# EasyEDA Pro project WaterPumpDriver.eprj

# Schematic Schematic1
Board Name: Board1; Create Date: 2025-04-06; Page Name: P1; Project Name: WaterPumpDriver; Schematic Name: Schematic1; Update Date: 2025-04-06; Company: 嘉立创EDA; Drawed: 王大智; Page Size: A4; Version: V1.0
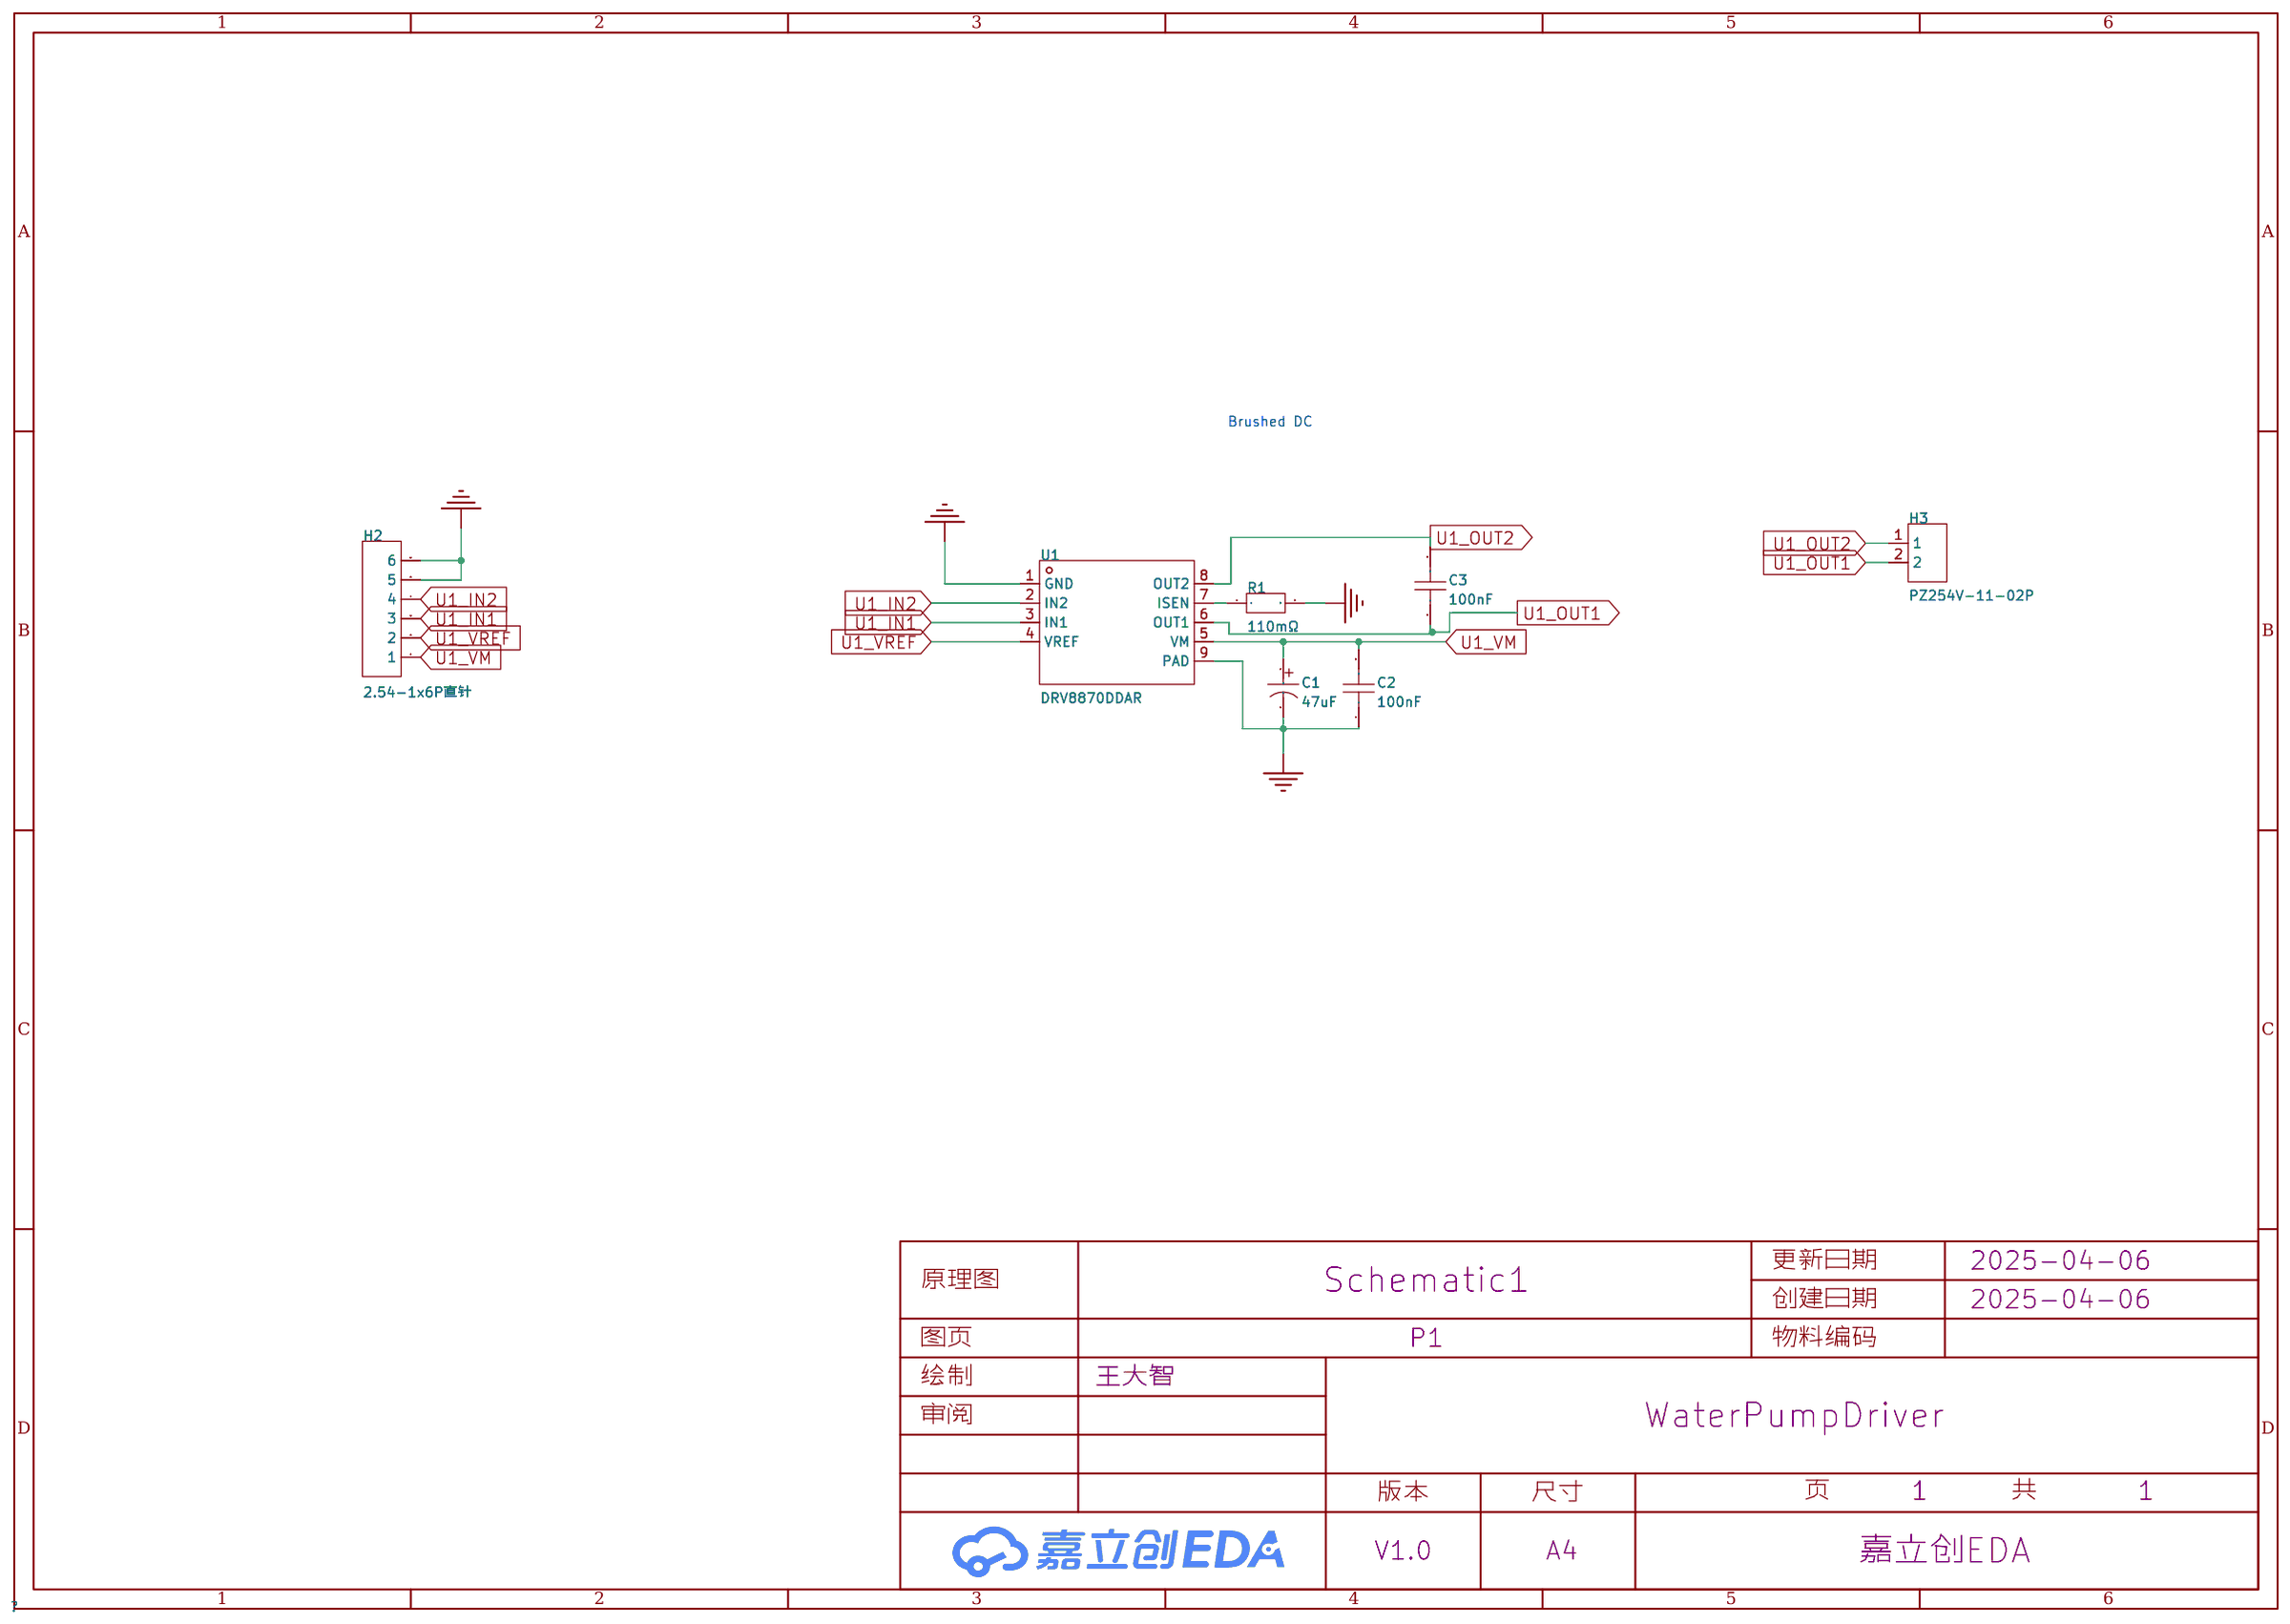
[diagram p0: schematic sheet]

## Parts
C1  47uF  [CAP-TH_BD6.3-P2.50-D1.0-FD]
C2  100nF  [C0603]
C3  100nF  [C0603]
H2  2.54-1x6P直针  [HDR-TH_6P-P2.54-V-M-1]
H3  PZ254V-11-02P  [HDR-TH_2P-P2.54-V-M]
R1  110mΩ  [R1206]
U1  DRV8870DDAR  [HSOP-8_L5.0-W4.0-P1.27-LS6.2-BL-EP]

## Library data of the parts
C1 = KM476M050E11RR0VH2FP0: LCSC Part Name: 47uF ±20% 50V; Supplier Part: C45101; Manufacturer: CX(承兴); Supplier Footprint: 插件,D6.3xL11mm; JLCPCB Part Class: 扩展库; Datasheet: https://atta.szlcsc.com/upload/public/pdf/source/20230413/4F329AA96A66424FD3FF29340EA7427F.pdf; Supplier: LCSC; Tolerance: ±20%; Rated Voltage: 50V; Lead Spacing: 2.5mm; φD: 6.3mm; L: 11mm; Lifetime @ Temp: 1000hrs@105℃
C2 C3 = CGA0603X7R104K500JT: LCSC Part Name: 100nF ±10% 50V; Supplier Part: C6119867; Manufacturer: HRE(芯声); Supplier Footprint: 0603; JLCPCB Part Class: Extended Part; Datasheet: https://atta.szlcsc.com/upload/public/pdf/source/20250103/C44077DA9E7B3EFAE02F22B6D3D1CBC9.pdf; Supplier: LCSC; Tolerance: ±10%; Voltage Rating: 50V; Temperature Coefficient: X7R
H2 = 2.54-1x6P直针: LCSC Part Name: 1x6P 间距:2.54mm 方针 直插; Supplier Part: C37208; Manufacturer: BOOMELE(博穆精密); Supplier Footprint: 插件,P=2.54mm; JLCPCB Part Class: 扩展库; Datasheet: https://atta.szlcsc.com/upload/public/pdf/source/20250115/42A019761A40C8B839643401D8CA5A96.pdf; Supplier: LCSC; Pin Structure: 1x6P; Pitch: 2.54mm; Circluar Pins/Square Pins: 方针; Mounting Type: 直插; Number of Rows: 单排; Number of Pins: 6P; Current Rating: 3A; Contact Material: 黄铜; Operating Temperature: -40℃~+105℃; Color: 黑色
H3 = PZ254V-11-02P: LCSC Part Name: 1x2P 间距:2.54mm 方针 直插; Supplier Part: C492401; Manufacturer: XFCN(兴飞); Supplier Footprint: 插件,P=2.54mm; JLCPCB Part Class: 扩展库; Datasheet: https://atta.szlcsc.com/upload/public/pdf/source/20200309/C492401_A812433581A9B211A7FFA413ADDFF0E5.pdf; Supplier: LCSC; Pin Structure: 1x2P; Pitch: 2.54mm; Circluar Pins/Square Pins: 方针; Mounting Type: 直插; Number of Rows: 单排; Number of Pins: 2P; Length of Mating Pin: 6mm; Insulation Height: 2.5mm; Length of End Connection Pin: 3mm; Contact Material: 黄铜; Operating Temperature: -40℃~+105℃; Color: 黑色
R1 = FRL1206FR110TS: LCSC Part Name: 110mΩ ±1% 250mW 厚膜电阻; Supplier Part: C2934288; Manufacturer: FOJAN(富捷); Supplier Footprint: 1206; JLCPCB Part Class: 扩展库; Datasheet: https://atta.szlcsc.com/upload/public/pdf/source/20211221/925EC7D7225764EE0046F22065062C87.pdf; Supplier: LCSC; Type: 厚膜电阻; Tolerance: ±1%; Power(Watts): 250mW; Overload Voltage (Max): 500V; Temperature Coefficient: ±600ppm/℃; Operating Temperature Range: -55℃~+155℃
U1 = DRV8870DDAR: Supplier Part: C86590; Manufacturer: TI(德州仪器); Supplier Footprint: HSOP-8-EP; JLCPCB Part Class: 扩展库; Datasheet: https://www.ti.com/cn/lit/gpn/drv8870; Supplier: LCSC

## Nets
GND: C1.2 C2.1 H2.5 H2.6 R1.2 U1.1(GND) U1.9(PAD)
U1_IN1: H2.3 U1.3(IN1)
U1_IN2: H2.4 U1.2(IN2)
U1_OUT1: C3.1 H3.2 U1.6(OUT1)
U1_OUT2: C3.2 H3.1 U1.8(OUT2)
U1_VM: C1.1 C2.2 H2.1 U1.5(VM)
U1_VREF: H2.2 U1.4(VREF)
$1N341: R1.1 U1.7(ISEN)

## Notes on the sheet
- Brushed DC

# Board PCB1
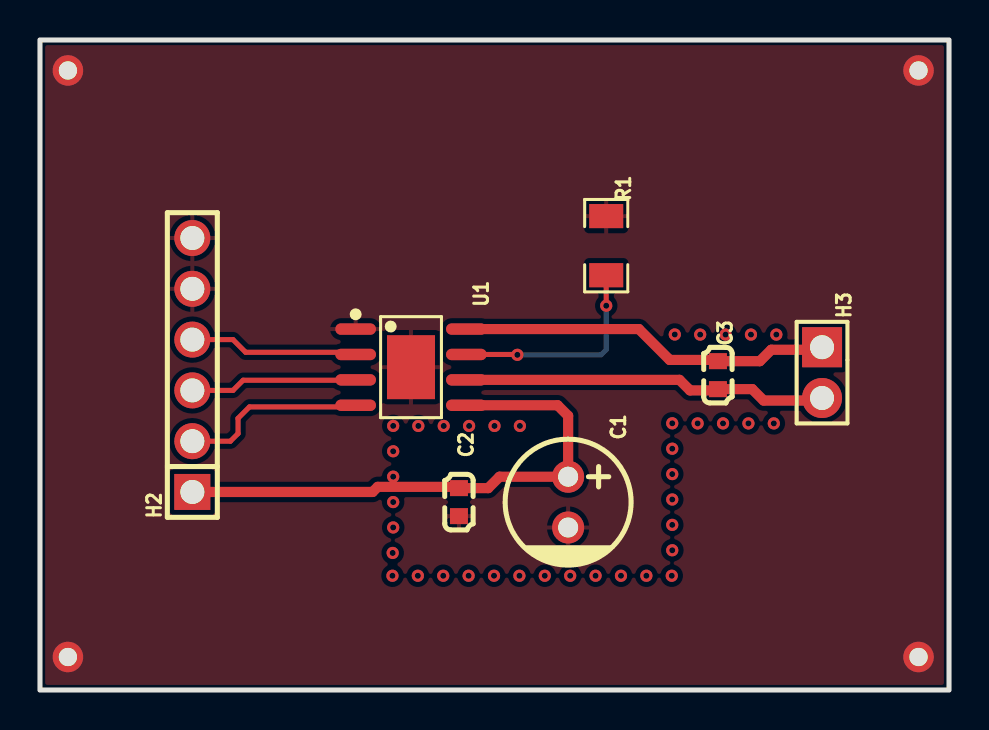
[diagram p1: board, top side]
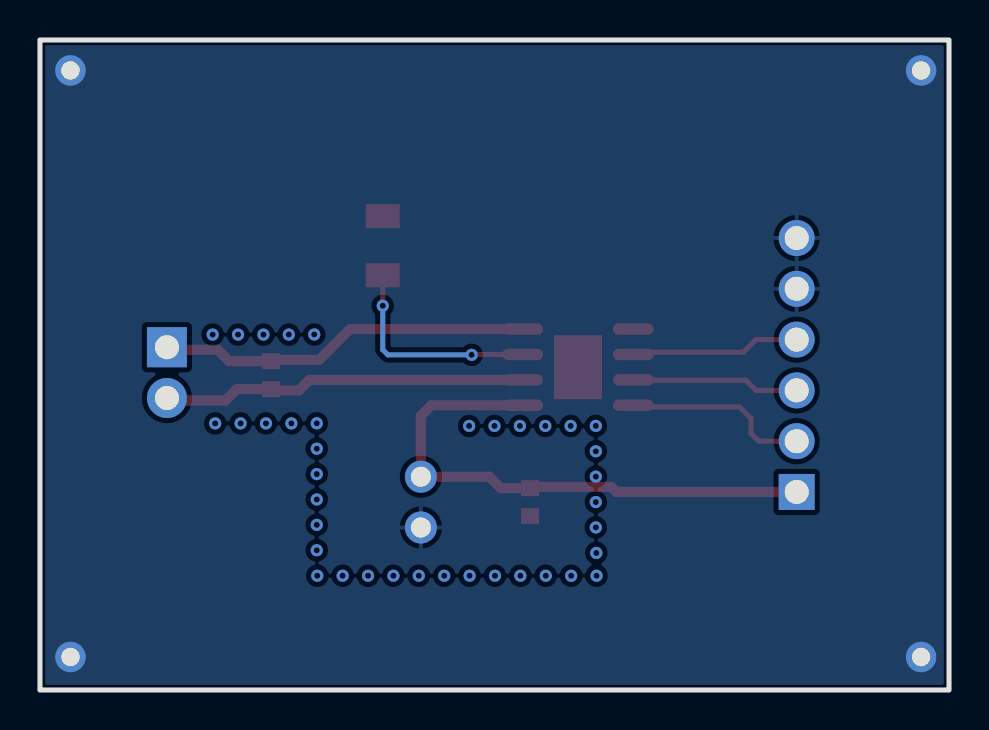
[diagram p2: board, bottom side, seen from below]

Outline 45.47 x 32.51 mm; copper layers: Top Layer, Bottom Layer. Coordinates in mm from the lower left corner of the outline.
Outline path: rectangle 0,32.51 45.47,0
Stack: Top Layer 0.035mm / Dielectric1 1.51mm FR4 er 4.5 / Bottom Layer 0.035mm

## Design rules (mm)
template: JLCPCB Capability(Two Layers Board)
spacing copperThickness1oz (default): track to track 0.102, other pairs 0.152 to 0.3
spacing copperThickness2oz: track to track 0.203, other pairs 0.152 to 0.3
track width copperThickness1oz (default): min 0.127, default 0.254, max 2.54
track width copperThickness2oz: min 0.203, default 0.254, max 2.54
differential pair differentialPair (default): width min 0.127, default 0.254, max 2.54; gap min 0.152, default 0.152
via viaSize (default): diameter min 0.5, default 0.61, max 10; hole min 0.3, default 0.305, max 6.3

## Placement (name value [footprint] x y rotation side)
C1  47uF  [CAP-TH_BD6.3-P2.50-D1.0-FD]  26.42 9.4 270 top
C2  100nF  [C0603]  20.96 9.4 90 top
C3  100nF  [C0603]  33.91 15.75 90 top
H2  2.54-1x6P直针  [HDR-TH_6P-P2.54-V-M-1]  7.62 16.26 90 top
H3  PZ254V-11-02P  [HDR-TH_2P-P2.54-V-M]  39.12 15.88 270 top
NOREF  -  [Pad_e205]  1.4 30.99 0 top
NOREF#2  -  [Pad_e206]  43.94 30.99 0 top
NOREF#3  -  [Pad_e208]  43.94 1.65 0 top
NOREF#4  -  [Pad_e207]  1.4 1.65 0 top
R1  110mΩ  [R1206]  28.32 22.22 90 top
U1  DRV8870DDAR  [HSOP-8_L5.0-W4.0-P1.27-LS6.2-BL-EP]  18.56 16.15 270 top

## Footprints (pads in the part's own frame, mm; a bottom-side part is the same pattern mirrored in y, then rotated)
C0603
  rect 0.8x0.9 smd: 1(-0.7,0) 2(0.7,0)
CAP-TH_BD6.3-P2.50-D1.0-FD
  round 1.6 hole 1: 1(-1.27,0) 2(1.27,0)
HDR-TH_2P-P2.54-V-M
  rect 2x2 hole 1.2: 1(-1.27,0)
  round 2 hole 1.2: 2(1.27,0)
HDR-TH_6P-P2.54-V-M-1
  rect 1.8x1.8 hole 1.2: 1(-6.35,0)
  round 1.8 hole 1.2: 2(-3.81,0) 3(-1.27,0) 4(1.27,0) 5(3.81,0) 6(6.35,0)
HSOP-8_L5.0-W4.0-P1.27-LS6.2-BL-EP
  oval 0.574x2.038 smd: 1(-1.905,-2.769) 2(-0.635,-2.769) 3(0.635,-2.769) 4(1.905,-2.769) 5(1.905,2.769) 6(0.635,2.769) 7(-0.635,2.769) 8(-1.905,2.769)
  rect 3.2x2.4 smd: 9(0,0)
Pad_e205
  round 1.524 hole 0.914: 1(0,0)
Pad_e206
  round 1.524 hole 0.914: 2(0,0)
Pad_e207
  round 1.524 hole 0.914: 3(0,0)
Pad_e208
  round 1.524 hole 0.914: 4(0,0)
R1206
  rect 1.208x1.701 smd: 1(-1.479,0) 2(1.479,0)

## Nets
As in the schematic, except:
GND: C1.2 C2.1 H2.5 H2.6 NOREF.1 NOREF#2.2 NOREF#3.4 NOREF#4.3 R1.2 U1.1 U1.9

## Via types
v1: diameter 0.61, hole 0.305, Top Layer to Bottom Layer, 40 vias

## Routing (per net, layer and track width the routed paths; a pad name or vN(x,y) marks a point on that pad's centre or on a via; arc(x,y) is an arc through that point)
(no net):
  vias: v1(17.64,6.86) v1(17.63,5.72) v1(17.67,13.21) v1(17.67,11.94) v1(17.67,9.4) v1(17.67,8.13) v1(18.92,13.21) v1(18.9,5.72) v1(20.19,13.21) v1(20.17,5.72) v1(21.44,5.72) v1(21.46,13.21) v1(22.73,13.21) v1(22.71,5.72) v1(24,13.21) v1(23.98,5.72) v1(25.25,5.72) v1(26.52,5.72) v1(27.79,5.72) v1(29.06,5.72) v1(30.33,5.72) v1(31.62,13.34) v1(31.62,12.07) v1(31.62,10.8) v1(31.62,9.53) v1(31.62,8.26) v1(31.62,6.99) v1(31.6,5.72) v1(31.75,17.78) v1(32.89,13.33) v1(33.02,17.78) v1(34.16,13.33) v1(34.29,17.78) v1(35.43,13.33) v1(35.56,17.78) v1(36.7,13.33) v1(36.83,17.78)
U1_IN1: length 8.4
  Top Layer w0.254: H2.3 9.65,14.99 10.16,15.49 15.77,15.49 U1.3
U1_IN2: length 8.5
  Top Layer w0.254: U1.2 15.68,16.89 10.29,16.89 9.65,17.53 H2.4
U1_OUT1: length 18.3
  Top Layer w0.508: U1.6 31.99,15.51 32.51,14.99 33.85,14.99 C3.1 35.62,15.05 36.19,14.48 38.99,14.48 H3.2
U1_OUT2: length 18.7
  Top Layer w0.508: U1.8 29.95,18.05 31.5,16.51 33.85,16.51 C3.2 36.01,16.45 36.58,17.02 38.99,17.02 H3.1
U1_VM: length 27.5
  Top Layer w0.508: U1.5 25.89,14.24 26.42,13.72 C1.1 22.99,10.67 22.42,10.1 C2.2 20.89,10.16 16.89,10.16 16.64,9.91 H2.1
  vias: v1(17.67,10.67)
U1_VREF: length 9.4
  Top Layer w0.254: U1.4 15.71,14.16 10.48,14.16 9.91,13.59 9.91,12.83 9.53,12.45 H2.2
$1N341: length 10.8
  Top Layer w0.254: v1(23.88,16.76) 23.86,16.78 U1.7 ; v1(28.32,19.22) R1.1
  Bottom Layer w0.254: v1(23.88,16.76) 28.07,16.76 28.32,17.02 v1(28.32,19.22)

## Copper pours and planes (outline as drawn; the poured copper is in the pictures)
GND on Top Layer: -3.68,35.18 49.78,35.18 49.78,-4.83 -3.68,-4.83
GND on Bottom Layer: -6.35,37.21 52.32,37.21 52.32,-7.24 -6.35,-7.24
